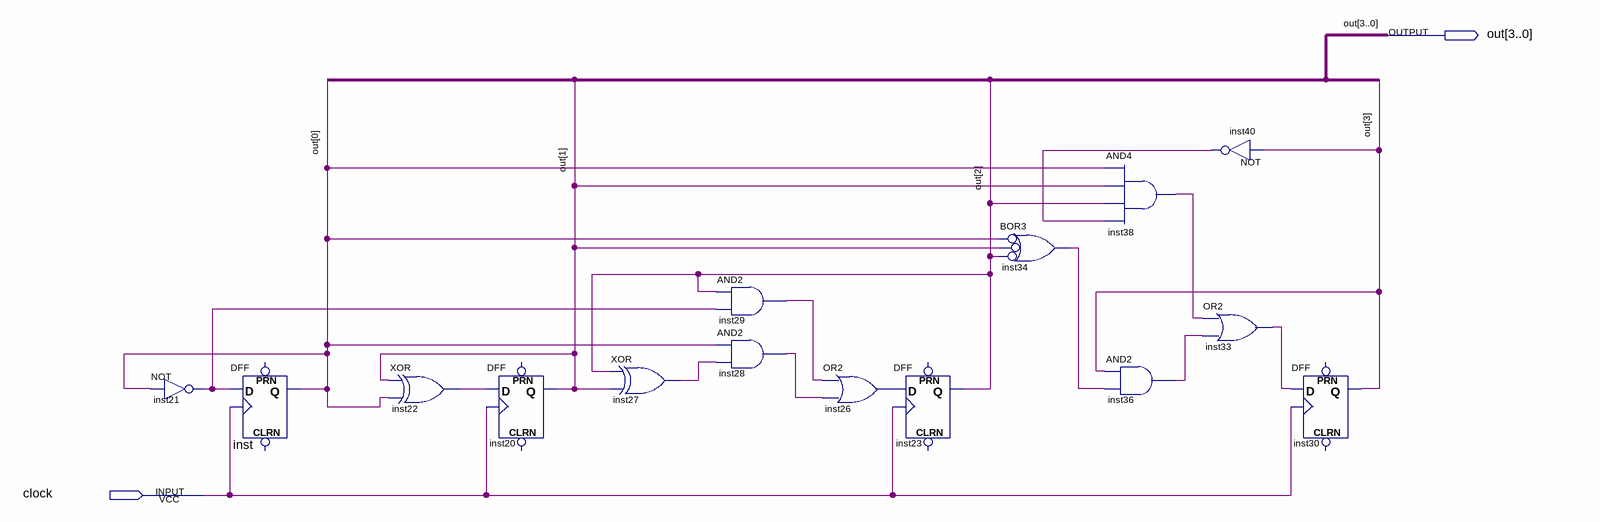
[diagram p0: schematic sheet]
// Quartus schematic counter16.bdf as structural Verilog: 15 symbols, 2 pins
module counter16 (
  input  clock,
  output [3:0] out
);

  wire inst21_out, inst22_out, inst26_out, inst27_out, inst28_out, inst29_out, inst33_out, inst34_out,
       inst36_out, inst38_out, inst40_out;

  not inst21 (inst21_out, out[0]);
  DFF inst (.CLK(clock), .D(inst21_out), .Q(out[0]));  // open: CLRN, PRN
  xor inst22 (inst22_out, out[1], out[0]);
  DFF inst20 (.CLK(clock), .D(inst22_out), .Q(out[1]));  // open: CLRN, PRN
  xor inst27 (inst27_out, out[2], out[1]);
  and inst29 (inst29_out, out[2], inst21_out);
  and inst28 (inst28_out, out[0], inst27_out);
  or inst26 (inst26_out, inst29_out, inst28_out);
  DFF inst23 (.CLK(clock), .D(inst26_out), .Q(out[2]));  // open: CLRN, PRN
  or inst34 (inst34_out, ~out[0], ~out[1], ~out[2]);  // BOR3
  and inst38 (inst38_out, out[0], out[1], out[2], inst40_out);
  and inst36 (inst36_out, out[3], inst34_out);
  not inst40 (inst40_out, out[3]);
  or inst33 (inst33_out, inst38_out, inst36_out);
  DFF inst30 (.CLK(clock), .D(inst33_out), .Q(out[3]));  // open: CLRN, PRN
endmodule
